# EAGLE design Actuator_v2 (EAGLE 9.6.2)

## Sheet 1 of 2: Part Schematics
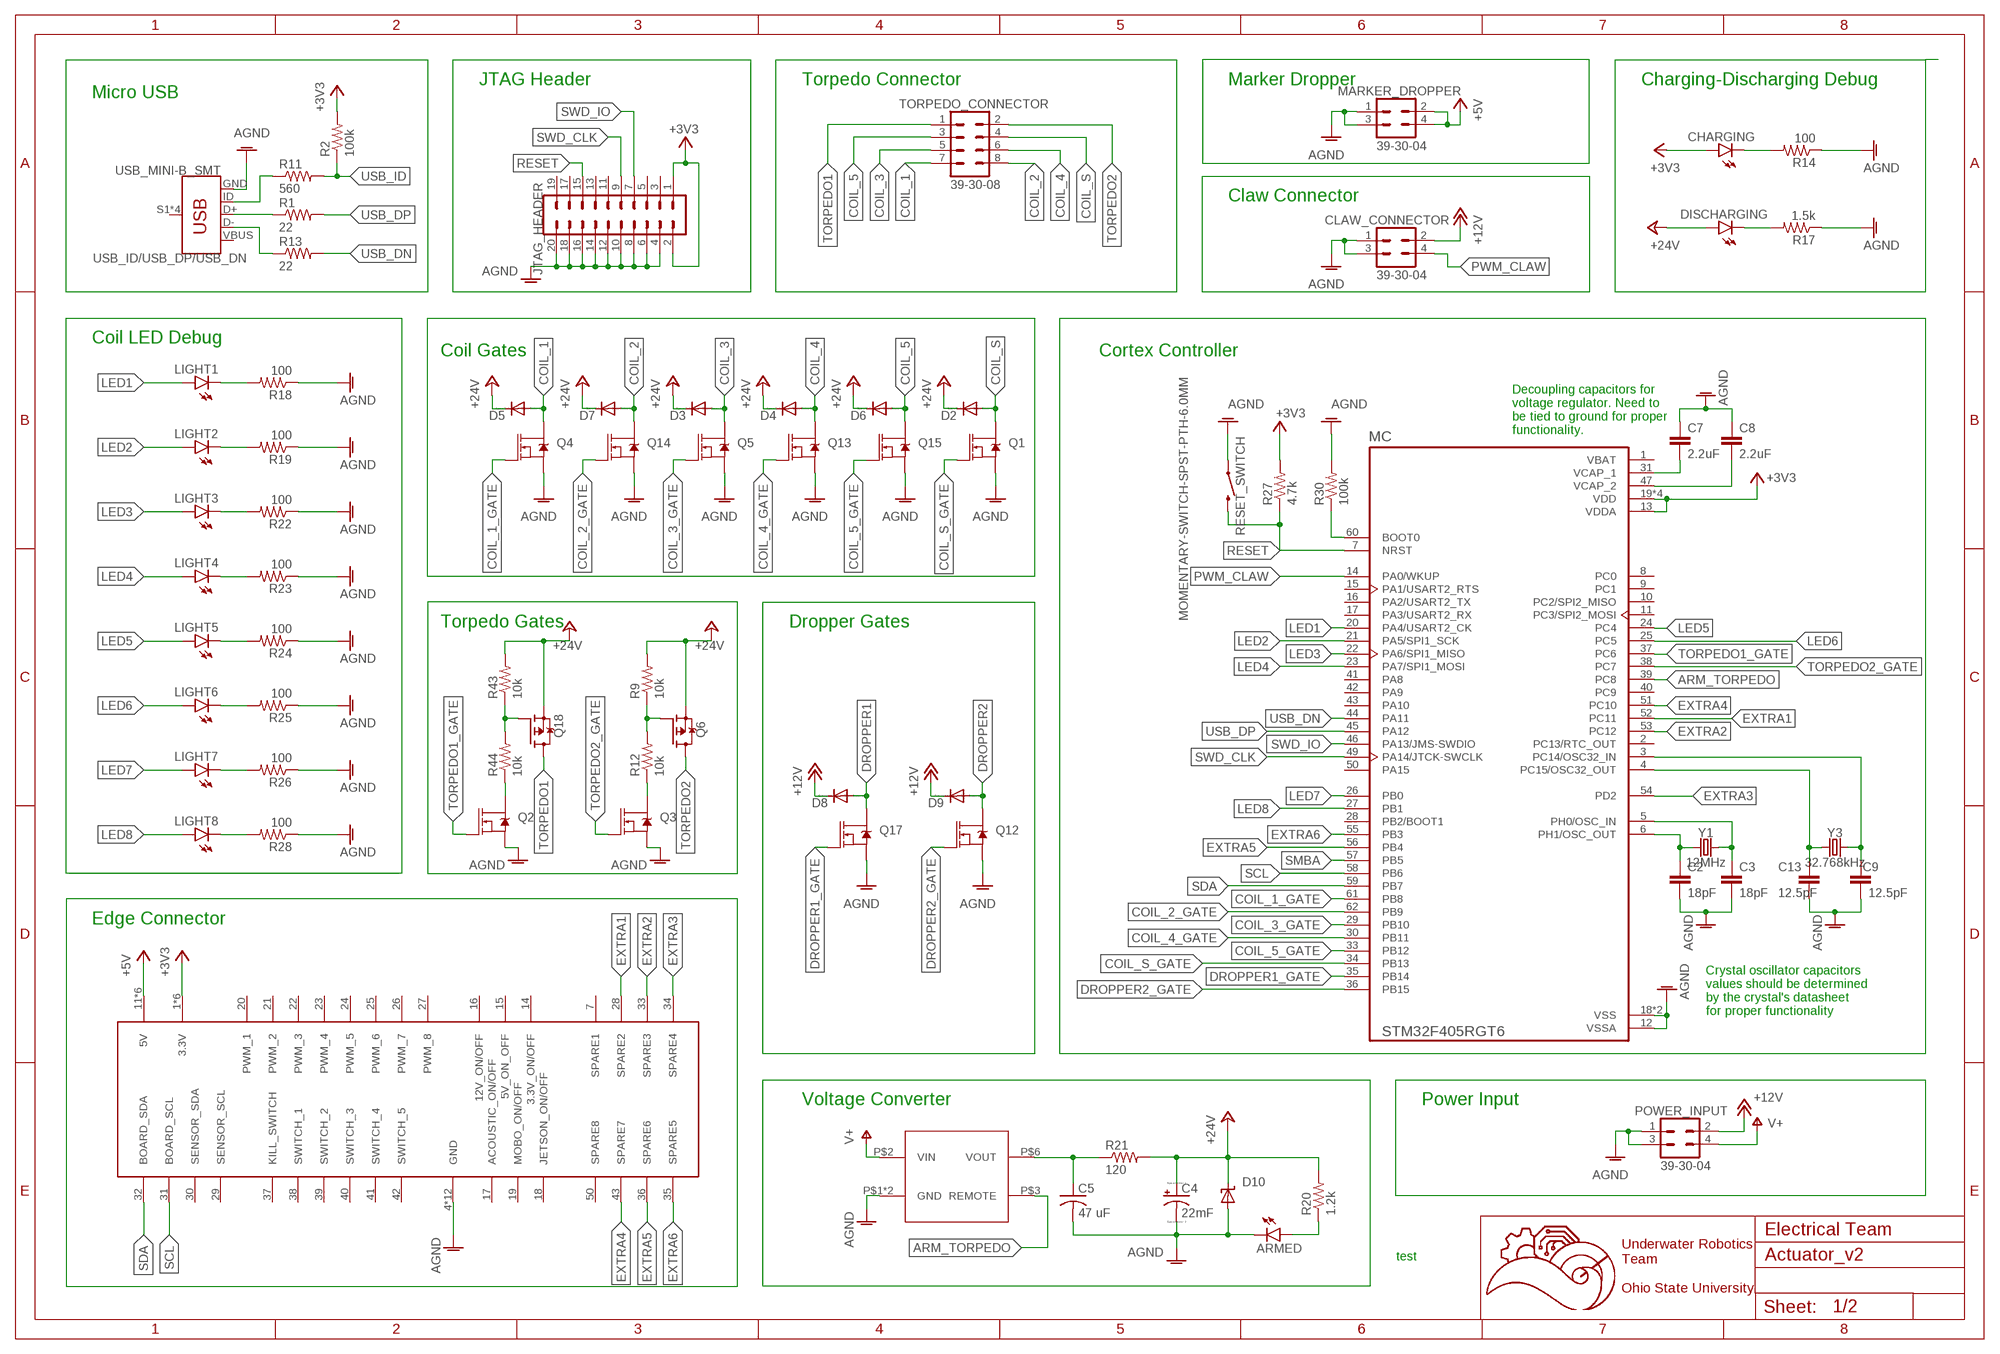
[diagram p0: schematic, sheet 1]

### Parts
ARMED  LEDCHIPLED_0603  [CHIPLED_0603]
C2  18pF  C-EUC0603  [C0603]
C3  18pF  C-EUC0603  [C0603]
C4  22mF  CPOL-USE10-30  [EB30D]
C5  47 uF  C-USC1206K  [C1206K]
C7  2.2uF  C-EUC0603  [C0603]
C8  2.2uF  C-EUC0603  [C0603]
C9  12.5pF  C-EUC0603  [C0603]
C13  12.5pF  C-EUC0603  [C0603]
CHARGING  LEDCHIPLED_0603  [CHIPLED_0603]
CLAW_CONNECTOR  39-30-04  [39-30-?04?]
D2  DIODE-SMB  [SMB]
D3  DIODE-SMB  [SMB]
D4  DIODE-SMB  [SMB]
D5  DIODE-SMB  [SMB]
D6  DIODE-SMB  [SMB]
D7  DIODE-SMB  [SMB]
D8  DIODE-SMB  [SMB]
D9  DIODE-SMB  [SMB]
D10  SUPPRESSOR-SMBJ  [SMBJ]
DISCHARGING  LEDCHIPLED_0603  [CHIPLED_0603]
JTAG_HEADER  CONN_10X2  [2X10]
LIGHT1  LEDCHIPLED_0603  [CHIPLED_0603]
LIGHT2  LEDCHIPLED_0603  [CHIPLED_0603]
LIGHT3  LEDCHIPLED_0603  [CHIPLED_0603]
LIGHT4  LEDCHIPLED_0603  [CHIPLED_0603]
LIGHT5  LEDCHIPLED_0603  [CHIPLED_0603]
LIGHT6  LEDCHIPLED_0603  [CHIPLED_0603]
LIGHT7  LEDCHIPLED_0603  [CHIPLED_0603]
LIGHT8  LEDCHIPLED_0603  [CHIPLED_0603]
MARKER_DROPPER  39-30-04  [39-30-?04?]
MC  STM32F405RGT6  [QFP50P1200X1200X160-64N]
POWER_INPUT  39-30-04  [39-30-?04?]
Q1  MOSFET-NCH-AO3404A  [SOT23-3]
Q2  MOSFET-NCH-AO3404A  [SOT23-3]
Q3  MOSFET-NCH-AO3404A  [SOT23-3]
Q4  MOSFET-NCH-AO3404A  [SOT23-3]
Q5  MOSFET-NCH-AO3404A  [SOT23-3]
Q6  FDD4141TO252  [TO252]
Q12  MOSFET-NCH-AO3404A  [SOT23-3]
Q13  MOSFET-NCH-AO3404A  [SOT23-3]
Q14  MOSFET-NCH-AO3404A  [SOT23-3]
Q15  MOSFET-NCH-AO3404A  [SOT23-3]
Q17  MOSFET-NCH-AO3404A  [SOT23-3]
Q18  FDD4141TO252  [TO252]
R1  22  R-US_R0603  [R0603]
R2  100k  R-US_R0603  [R0603]
R9  10k  R-US_R0603  [R0603]
R11  560  R-US_R0603  [R0603]
R12  10k  R-US_R0603  [R0603]
R13  22  R-US_R0603  [R0603]
R14  100  R-US_R0805  [R0805]
R17  1.5k  R-US_R0805  [R0805]
R18  100  R-US_R0805  [R0805]
R19  100  R-US_R0805  [R0805]
R20  1.2k  R-US_R0805  [R0805]
R21  120  R-US_R6332W  [R6332W]
R22  100  R-US_R0805  [R0805]
R23  100  R-US_R0805  [R0805]
R24  100  R-US_R0805  [R0805]
R25  100  R-US_R0805  [R0805]
R26  100  R-US_R0805  [R0805]
R27  4.7k  R-US_R0603  [R0603]
R28  100  R-US_R0805  [R0805]
R30  100k  R-US_R0603  [R0603]
R43  10k  R-US_R0603  [R0603]
R44  10k  R-US_R0603  [R0603]
RESET_SWITCH  MOMENTARY-SWITCH-SPST-PTH-6.0MM  [TACTILE_SWITCH_PTH_6.0MM]
TORPEDO_CONNECTOR  39-30-08  [39-30-?08?]
U$1  5530843-EDGE  [5530843-6-BOARDFINGERS]
U$6  TMR6-2415  [TMR6-2415]
USB_ID/USB_DP/USB_DN  USB_MINI-B_SMT  [USB-MINIB]
Y1  12MHz  CRYSTAL-16MHZPTH-HC49US  [HC49US]
Y3  32.768kHz  CRYSTAL-32.768KHZSMD-3.2X1.5  [CRYSTAL-SMD-3.2X1.5MM]

### Nets
+3V3: CHARGING.A JTAG_HEADER.1 JTAG_HEADER.2 MC.13(VDDA) MC.19(VDD) MC.32(VDD) MC.48(VDD) MC.64(VDD) R2.2 R27.2 U$1.1(3.3V) U$1.2(3.3V) U$1.3(3.3V) U$1.54(3.3V) U$1.55(3.3V) U$1.56(3.3V)
+5V: MARKER_DROPPER.2 MARKER_DROPPER.4 U$1.11(5V) U$1.12(5V) U$1.13(5V) U$1.44(5V) U$1.45(5V) U$1.46(5V)
+12V: CLAW_CONNECTOR.2 D8.C D9.C POWER_INPUT.2
+24V: C4.+ D2.C D3.C D4.C D5.C D6.C D7.C D10.C DISCHARGING.A Q6.2(S) Q18.2(S) R9.2 R20.2 R21.2 R43.2
AGND: ARMED.C C2.2 C3.2 C4.- C5.2 C7.1 C8.1 C9.2 C13.2 CLAW_CONNECTOR.1 CLAW_CONNECTOR.3 D10.A JTAG_HEADER.4 JTAG_HEADER.6 JTAG_HEADER.8 JTAG_HEADER.10 JTAG_HEADER.12 JTAG_HEADER.14 JTAG_HEADER.16 JTAG_HEADER.18 JTAG_HEADER.20 MARKER_DROPPER.1 MARKER_DROPPER.3 MC.12(VSSA) MC.18(VSS) MC.63(VSS) POWER_INPUT.1 POWER_INPUT.3 Q1.2(S) Q2.2(S) Q3.2(S) Q4.2(S) Q5.2(S) Q12.2(S) Q13.2(S) Q14.2(S) Q17.2(S) R14.1 R17.1 R18.1 R19.1 R22.1 R23.1 R24.1 R25.1 R26.1 R28.1 R30.2 RESET_SWITCH.1 U$1.4(GND) U$1.5(GND) U$1.6(GND) U$1.8(GND) U$1.9(GND) U$1.10(GND) U$1.47(GND) U$1.48(GND) U$1.49(GND) U$1.51(GND) U$1.52(GND) U$1.53(GND) U$6.P$1(GND) U$6.P$7(GND) USB_ID/USB_DP/USB_DN.GND
AGND1: Q15.2(S) ; supply symbol labelled AGND
ARM_TORPEDO: MC.39(PC8) U$6.P$3(REMOTE)
COIL_1: D5.A Q4.3(D) TORPEDO_CONNECTOR.7
COIL_1_GATE: MC.61(PB8) Q4.1(G)
COIL_2: D7.A Q14.3(D) TORPEDO_CONNECTOR.8
COIL_2_GATE: MC.62(PB9) Q14.1(G)
COIL_3: D3.A Q5.3(D) TORPEDO_CONNECTOR.5
COIL_3_GATE: MC.29(PB10) Q5.1(G)
COIL_4: D4.A Q13.3(D) TORPEDO_CONNECTOR.6
COIL_4_GATE: MC.30(PB11) Q13.1(G)
COIL_5: D6.A Q15.3(D) TORPEDO_CONNECTOR.3
COIL_5_GATE: MC.33(PB12) Q15.1(G)
COIL_S: D2.A Q1.3(D) TORPEDO_CONNECTOR.4
COIL_S_GATE: MC.34(PB13) Q1.1(G)
DROPPER1: D8.A Q17.3(D)
DROPPER1_GATE: MC.35(PB14) Q17.1(G)
DROPPER2: D9.A Q12.3(D)
DROPPER2_GATE: MC.36(PB15) Q12.1(G)
EXTRA1: MC.52(PC11) U$1.28(SPARE2)
EXTRA2: MC.53(PC12) U$1.33(SPARE3)
EXTRA3: MC.54(PD2) U$1.34(SPARE4)
EXTRA4: MC.51(PC10) U$1.43(SPARE7)
EXTRA5: MC.56(PB4) U$1.36(SPARE6)
EXTRA6: MC.55(PB3) U$1.35(SPARE5)
LED1: LIGHT1.A MC.20(PA4/USART2_CK)
LED2: LIGHT2.A MC.21(PA5/SPI1_SCK)
LED3: LIGHT3.A MC.22(PA6/SPI1_MISO)
LED4: LIGHT4.A MC.23(PA7/SPI1_MOSI)
LED5: LIGHT5.A MC.24(PC4)
LED6: LIGHT6.A MC.25(PC5)
LED7: LIGHT7.A MC.26(PB0)
LED8: LIGHT8.A MC.27(PB1)
N$2: C2.1 MC.6(PH1/OSC_OUT) Y1.1
N$3: C3.1 MC.5(PH0/OSC_IN) Y1.2
N$4: CHARGING.C R14.2
N$5: C8.2 MC.47(VCAP_2)
N$6: R11.1 USB_ID/USB_DP/USB_DN.ID
N$7: R1.1 USB_ID/USB_DP/USB_DN.D+
N$8: R13.1 USB_ID/USB_DP/USB_DN.D-
N$10: ARMED.A R20.1
N$11: C7.2 MC.31(VCAP_1)
N$12: C13.1 MC.4(PC15/OSC32_OUT) Y3.P$2
N$15: DISCHARGING.C R17.2
N$16: LIGHT1.C R18.2
N$17: LIGHT2.C R19.2
N$18: LIGHT3.C R22.2
N$19: LIGHT4.C R23.2
N$21: LIGHT5.C R24.2
N$22: LIGHT6.C R25.2
N$23: LIGHT7.C R26.2
N$24: LIGHT8.C R28.2
N$26: C5.1 R21.1 U$6.P$6(VOUT)
N$29: C9.1 MC.3(PC14/OSC32_IN) Y3.P$1
N$30: MC.60(BOOT0) R30.1
N$33: Q18.1(G) R43.1 R44.2
N$34: Q2.3(D) R44.1
N$35: Q6.1(G) R9.1 R12.2
N$36: Q3.3(D) R12.1
PWM_CLAW: CLAW_CONNECTOR.4 MC.14(PA0/WKUP)
RESET: JTAG_HEADER.15 MC.7(NRST) R27.1 RESET_SWITCH.3
SCL: MC.58(PB6) U$1.31(BOARD_SCL)
SDA: MC.59(PB7) U$1.32(BOARD_SDA)
SMBA: MC.57(PB5)
SWD_CLK: JTAG_HEADER.9 MC.49(PA14/JTCK-SWCLK)
SWD_IO: JTAG_HEADER.7 MC.46(PA13/JMS-SWDIO)
TORPEDO1: Q18.3(D) TORPEDO_CONNECTOR.1
TORPEDO1_GATE: MC.37(PC6) Q2.1(G)
TORPEDO2: Q6.3(D) TORPEDO_CONNECTOR.2
TORPEDO2_GATE: MC.38(PC7) Q3.1(G)
USB_DN: MC.44(PA11) R13.2
USB_DP: MC.45(PA12) R1.2
USB_ID: R2.1 R11.2
V+: POWER_INPUT.4 U$6.P$2(VIN)
Unconnected: JTAG_HEADER.3 JTAG_HEADER.5 JTAG_HEADER.11 JTAG_HEADER.13 JTAG_HEADER.17 JTAG_HEADER.19 MC.2(PC13/RTC_OUT) MC.8(PC0) MC.9(PC1) MC.10(PC2/SPI2_MISO) MC.11(PC3/SPI2_MOSI) MC.15(PA1/USART2_RTS) MC.16(PA2/USART2_TX) MC.17(PA3/USART2_RX) MC.28(PB2/BOOT1) MC.40(PC9) MC.41(PA8) MC.42(PA9) MC.43(PA10) MC.50(PA15) U$1.7(SPARE1) U$1.14(3.3V_ON/OFF) U$1.15(5V_ON_OFF) U$1.16(12V_ON/OFF) U$1.17(ACOUSTIC_ON/OFF) U$1.18(JETSON_ON/OFF) U$1.19(MOBO_ON/OFF) U$1.20(PWM_1) U$1.21(PWM_2) U$1.22(PWM_3) U$1.23(PWM_4) U$1.24(PWM_5) U$1.25(PWM_6) U$1.26(PWM_7) U$1.27(PWM_8) U$1.29(SENSOR_SCL) U$1.30(SENSOR_SDA) U$1.37(KILL_SWITCH) U$1.38(SWITCH_1) U$1.39(SWITCH_2) U$1.40(SWITCH_3) U$1.41(SWITCH_4) U$1.42(SWITCH_5) U$1.50(SPARE8) USB_ID/USB_DP/USB_DN.S1(SHIELD) USB_ID/USB_DP/USB_DN.S2(SHIELD) USB_ID/USB_DP/USB_DN.S3(SHIELD) USB_ID/USB_DP/USB_DN.S4(SHIELD)

### Notes on the sheet
- JTAG Header | Torpedo Connector | Marker Dropper | Charging-Discharging Debug
- Micro USB
- Claw Connector
- Coil LED Debug
- Coil Gates | Cortex Controller
- Decoupling capacitors for 
  voltage regulator. Need to
  be tied to ground for proper
  functionality.
- Torpedo Gates | Dropper Gates
- Edge Connector
- Crystal oscillator capacitors
  values should be determined
  by the crystal's datasheet
  for proper functionality
- Voltage Converter | Power Input
- Electrical Team
- test
- Underwater Robotics
  Team
  
  Ohio State University

## Sheet 2 of 2: Notes
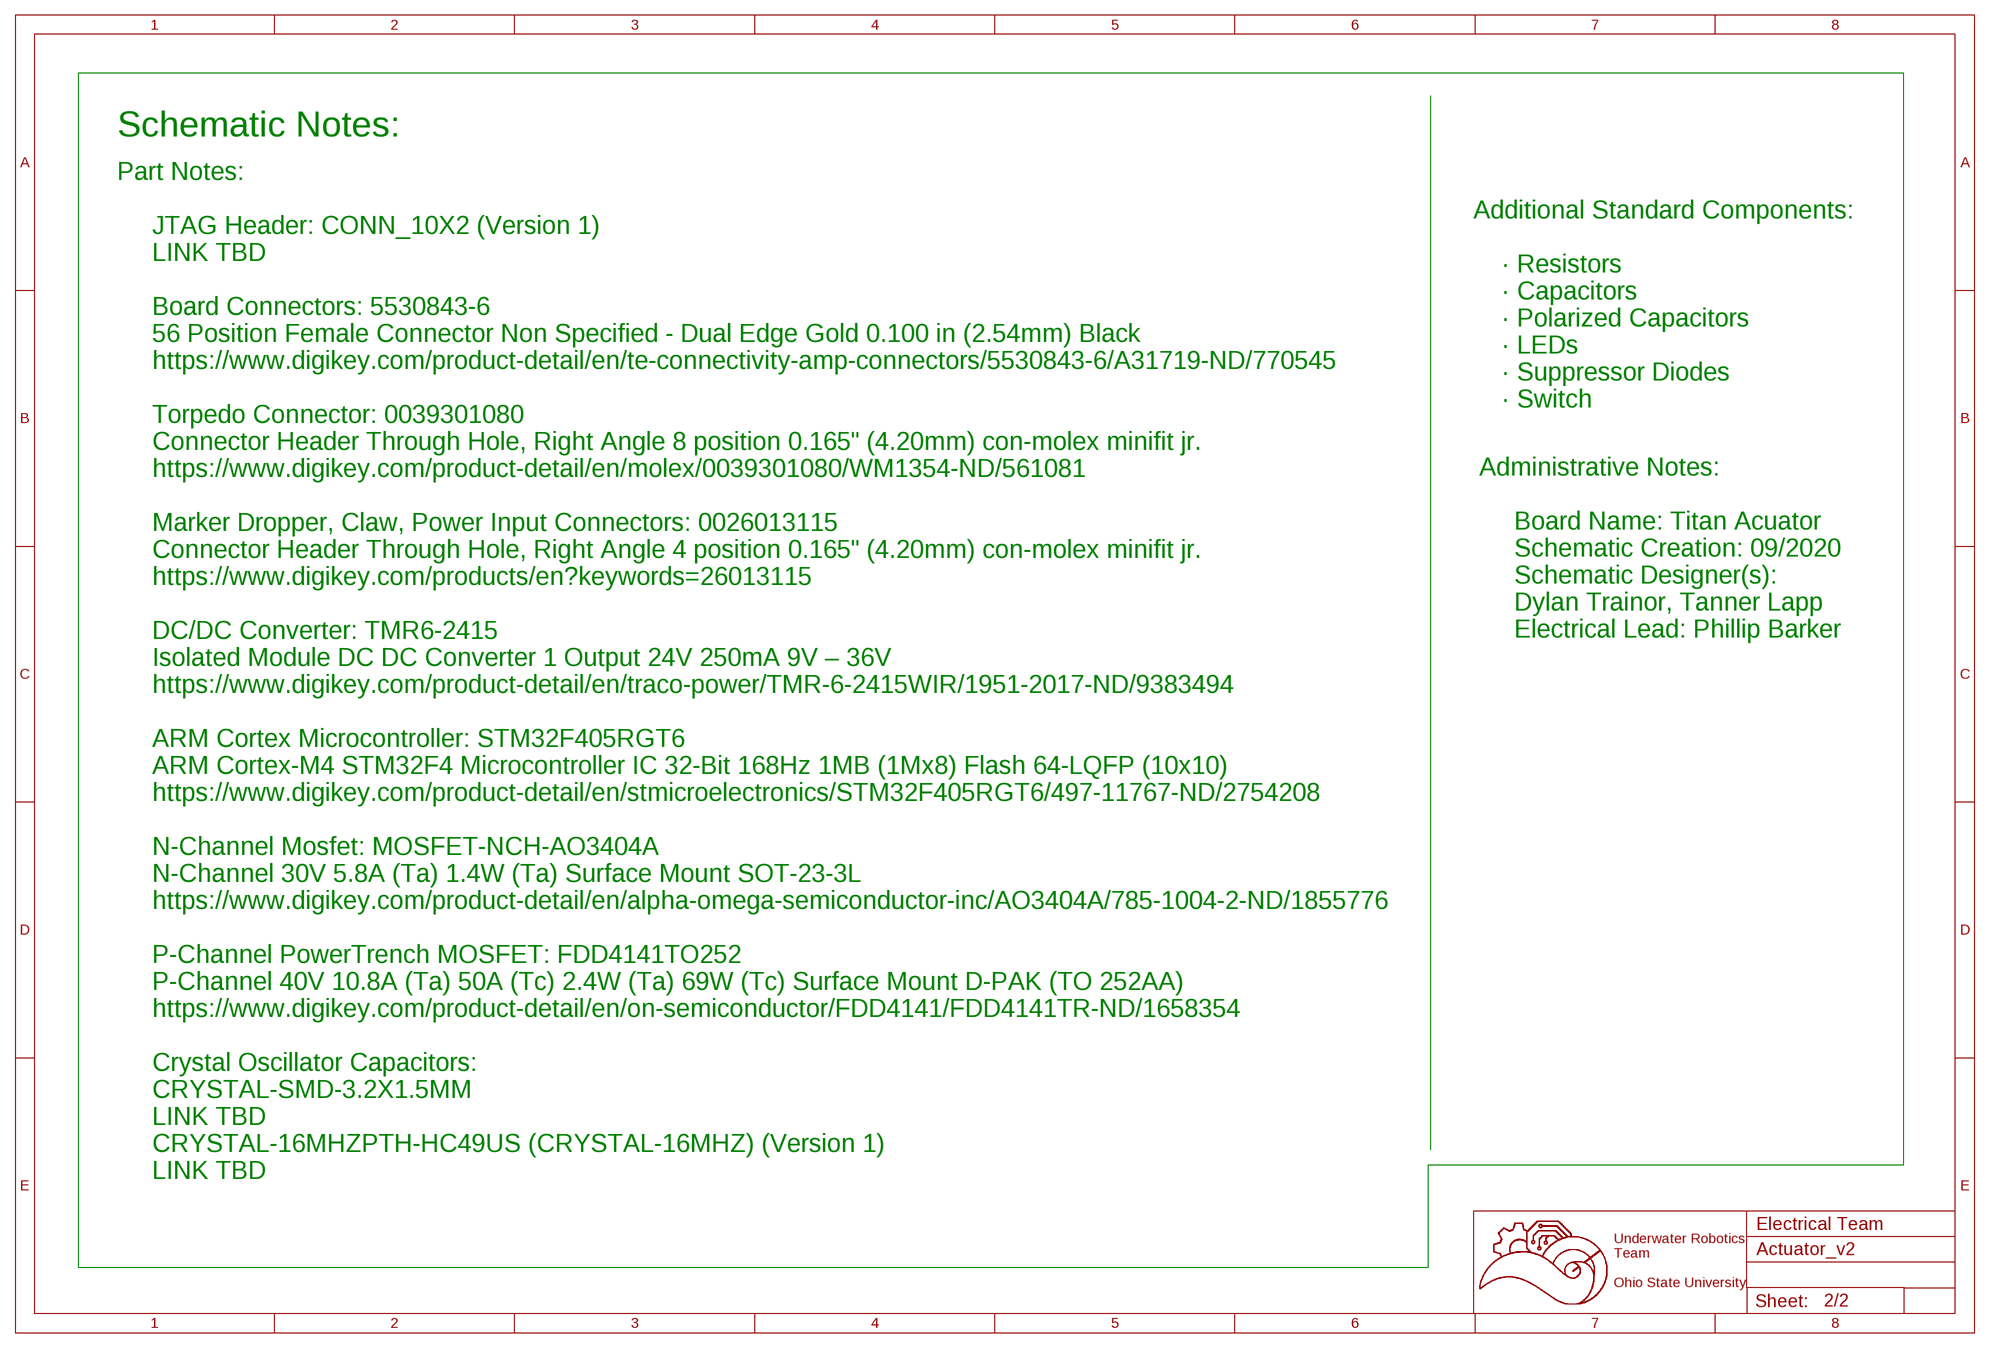
[diagram p1: schematic, sheet 2]

### Notes on the sheet
- Schematic Notes:
- Part Notes:
  
       JTAG Header: CONN_10X2 (Version 1) 
       LINK TBD 
    
       Board Connectors: 5530843-6 
       56 Position Female Connector Non Specified - Dual Edge Gold 0.100 in (2.54mm) Black 
       https://www.digikey.com/product-detail/en/te-connectivity-amp-connectors/5530843-6/A31719-ND/770545 
    
       Torpedo Connector: 0039301080 
       Connector Header Through Hole, Right Angle 8 position 0.165" (4.20mm) con-molex minifit jr. 
       https://www.digikey.com/product-detail/en/molex/0039301080/WM1354-ND/561081 
    
       Marker Dropper, Claw, Power Input Connectors: 0026013115 
       Connector Header Through Hole, Right Angle 4 position 0.165" (4.20mm) con-molex minifit jr. 
       https://www.digikey.com/products/en?keywords=26013115 
    
       DC/DC Converter: TMR6-2415 
       Isolated Module DC DC Converter 1 Output 24V 250mA 9V – 36V 
       https://www.digikey.com/product-detail/en/traco-power/TMR-6-2415WIR/1951-2017-ND/9383494 
    
       ARM Cortex Microcontroller: STM32F405RGT6 
       ARM Cortex-M4 STM32F4 Microcontroller IC 32-Bit 168Hz 1MB (1Mx8) Flash 64-LQFP (10x10) 
       https://www.digikey.com/product-detail/en/stmicroelectronics/STM32F405RGT6/497-11767-ND/2754208 
    
       N-Channel Mosfet: MOSFET-NCH-AO3404A 
       N-Channel 30V 5.8A (Ta) 1.4W (Ta) Surface Mount SOT-23-3L 
       https://www.digikey.com/product-detail/en/alpha-omega-semiconductor-inc/AO3404A/785-1004-2-ND/1855776 
    
       P-Channel PowerTrench MOSFET: FDD4141TO252 
       P-Channel 40V 10.8A (Ta) 50A (Tc) 2.4W (Ta) 69W (Tc) Surface Mount D-PAK (TO 252AA) 
       https://www.digikey.com/product-detail/en/on-semiconductor/FDD4141/FDD4141TR-ND/1658354 
    
       Crystal Oscillator Capacitors: 
       CRYSTAL-SMD-3.2X1.5MM 
       LINK TBD 
       CRYSTAL-16MHZPTH-HC49US (CRYSTAL-16MHZ) (Version 1) 
       LINK TBD
- Additional Standard Components:
  
       · Resistors 
       · Capacitors 
       · Polarized Capacitors 
       · LEDs 
       · Suppressor Diodes 
       · Switch
- Administrative Notes:
  
       Board Name: Titan Acuator
       Schematic Creation: 09/2020
       Schematic Designer(s): 
       Dylan Trainor, Tanner Lapp
       Electrical Lead: Phillip Barker
- Electrical Team
- Underwater Robotics
  Team
  
  Ohio State University

## Power pins joined to a net without a drawn wire
VBAT: MC.1(VBAT)
VBUS: USB_ID/USB_DP/USB_DN.VBUS

## Library data of the parts
ARMED CHARGING DISCHARGING LIGHT1-LIGHT8 = led:LED: LED OSRAM: - CHIPLED LG R971, LG N971, LY N971, LG Q971, LY Q971, LO R971, LY R971 LH N974, LH R974 LS Q976, LO Q976, LY Q976 LO Q996 - Hyper CHIPLED LW Q18S LB Q993, LB Q99A, LB R99A - SideLED LS A670, LO A670, LY A670, LG A670, LP A670 LB A673, LV A673, LT A673, LW A673 LH A674 LY A675 LS A676, LA A676, LO A676, LY A676, LW A676 LS A679, LY A679, LG A679 - Hyper Micro SIDELED® LS Y876, LA Y876, LO Y876, LY Y876 LT Y87S - SmartLED LW L88C, LW L88S LB L89C, LB L89S, LG L890 LS L89K, LO L89K, LY L89K LS L896, LA L896, LO L896, LY L896 - TOPLED LS T670, LO T670, LY T670, LG T670, LP T670 LSG T670, LSP T670, LSY T670, LOP T670, LYG T670 LG T671, LOG T671, LSG T671 LB T673, LV T673, LT T673, LW T673 LH T674 LS T676, LA T676, LO T676, LY T676, LB T676, LH T676, LSB T676, LW T676 LB T67C, LV T67C, LT T67C, LS T67K, LO T67K, LY T67K, LW E67C LS E67B, LA E67B, LO E67B, LY E67B, LB E67C, LV E67C, LT E67C LW T67C LS T679, LY T679, LG T679 LS T770, LO T770, LY T770, LG T770, LP T770 LB T773, LV T773, LT T773, LW T773 LH T774 LS E675, LA E675, LY E675, LS T675 LS T776, LA T776, LO T776, LY T776, LB T776 LHGB T686 LT T68C, LB T68C - Hyper Mini TOPLED® LB M676 - Mini TOPLED Santana® LG M470 LS M47K, LO M47K, LY M47K Source: http://www.osram.convergy.de LUXEON: - LUMILED® LXK2-PW12-R00, LXK2-PW12-S00, LXK2-PW14-U00, LXK2-PW14-V00 LXK2-PM12-R00, LXK2-PM12-S00, LXK2-PM14-U00 LXK2-PE12-Q00, LXK2-PE12-R00, LXK2-PE12-S00, LXK2-PE14-T00, LXK2-PE14-U00 LXK2-PB12-K00, LXK2-PB12-L00, LXK2-PB12-M00, LXK2-PB14-N00, LXK2-PB14-P00, LXK2-PB14-Q00 LXK2-PR12-L00, LXK2-PR12-M00, LXK2-PR14-Q00, LXK2-PR14-R00 LXK2-PD12-Q00, LXK2-PD12-R00, LXK2-PD12-S00 LXK2-PH12-R00, LXK2-PH12-S00 LXK2-PL12-P00, LXK2-PL12-Q00, LXK2-PL12-R00 Source: www.luxeon.com KINGBRIGHT: KA-3528ASYC Source: www.kingbright.com
C2 C3 C7-C9 C13 = rcl:C-EU: CAPACITOR, European symbol; SPICEPREFIX: C
C4 = resistor:CPOL-US: POLARIZED CAPACITOR, American symbol
C5 = resistor:C-US: CAPACITOR, American symbol
CLAW_CONNECTOR MARKER_DROPPER POWER_INPUT = con-molex-mini-fit:39-30-?04?: HEADER
D2-D9 = diode:DIODE-: DIODE
D10 = diode:SUPPRESSOR-: Suppressor diode
JTAG_HEADER = SparkFun-Connectors:CONN_10X2: Multi connection point. Often used as Generic Header-pin footprint for 0.1 inch spaced/style header connections On any of the 0.1 inch spaced packages, you can populate with these: Break Away Headers - Straight <https://www.sparkfun.com/products/116> (PRT-00116) Break Away Male Headers - Right Angle <https://www.sparkfun.com/products/553> (PRT-00553) Female Headers <https://www.sparkfun.com/products/115> (PRT-00115) Break Away Headers - Machine Pin <https://www.sparkfun.com/products/117> (PRT-00117) Break Away Female Headers - Swiss Machine Pin <https://www.sparkfun.com/products/743> (PRT-00743) Special note about the "SPECIAL" package: This was SPECIALLY designed to be used with our Graphic LCD Backpack. Be sure you want to use this! It is not only staggered on each line of header holes, but IT IS ALSO offset of the center point of the top and bottom lines by 5 mil. This causes the headers to lock into place on the "standard" footprint on the LCD screen. The extra squares on the tdocu layer are there simply to reference other pins (if you were to actually populate a longer header than ten long - this is what we do with the backpacks).
MC = STM32F405RGT6:STM32F405RGT6: High-performance foundation line, ARM Cortex-M4 core with DSP and FPU, 1 Mbyte Flash, 168 MHz CPU, ART Accelerator; AVAILABILITY: Unavailable; DESCRIPTION: High-performance foundation line, ARM Cortex-M4 core with DSP and FPU, 1 Mbyte Flash, 168 MHz CPU, ART Accelerator; MF: STMicroelectronics; MP: STM32F405RGT6; PACKAGE: LQFP-64 STMicroelectronics; PRICE: None
Q1-Q5 Q12-Q15 Q17 = SparkFun-DiscreteSemi:MOSFET-NCH: N-channel MOSFETs Voltage controlled devices that allow control of high current outputs. SparkFun Products: SparkFun OpenScale <https://www.sparkfun.com/products/13261> SparkFun Digital Sandbox <https://www.sparkfun.com/products/12651> SparkFun Monster Moto Shield <https://www.sparkfun.com/products/10182> SparkFun MOSFET Power Controller <https://www.sparkfun.com/products/11214>; PROD_ID: TRANS-12988; VALUE: 5.8A/30V/35mΩ
Q6 Q18 = transistor-fet:FDD4141: P-Channel PowerTrench® MOSFET Source: FDD4141.pdf
R1 R2 R11 R13 R27 R30 = rcl:R-US_: RESISTOR, American symbol; SPICEPREFIX: R
R9 R12 R14 R17-R26 R28 R43 R44 = resistor:R-US_: RESISTOR, American symbol
RESET_SWITCH = SparkFun-Switches:MOMENTARY-SWITCH-SPST: Momentary Switch (Pushbutton) - SPST Normally-open (NO) SPST momentary switches (buttons, pushbuttons). Variants PTH-12MM - 12mm square, through-hole Momentary Pushbutton Switch - 12mm Square <https://www.sparkfun.com/products/9190> (COM-09190) PTH-6.0MM, PTH-6.0MM-KIT - 6.0mm square, through-hole Mini Pushbutton Switch <https://www.sparkfun.com/products/97> (COM-00097) KIT package intended for soldering kit's - only one side of pads' copper is exposed. PTH-RIGHT-ANGLE-KIT - Right-angle, through-hole Right Angle Tactile Button <https://www.sparkfun.com/products/10791> - Used on SparkFun BigTime Watch Kit <https://www.sparkfun.com/products/11734> SMD-12MM - 12mm square, surface-mount Tactile Button - SMD (12mm) <https://www.sparkfun.com/products/12993> (COM-12993) Used on SparkFun PicoBoard <https://www.sparkfun.com/products/11888> SMD-4.5MM - 4.5mm Square Trackball Switch Used on SparkFun Blackberry Trackballer Breakout <https://www.sparkfun.com/products/13169> SMD-4.6MMX2.8MM - 4.60mm x 2.80mm, surface mount Used on SparkFun SAMD21 Mini Breakout <https://www.sparkfun.com/products/13664> SMD-5.2MM, SMD-5.2-REDUNDANT - 5.2mm square, surface-mount Mini Pushbutton Switch - SMD <https://www.sparkfun.com/products/8720> (COM-08720) Used on Arduino Pro Mini <https://www.sparkfun.com/products/11114> REDUNDANT package connects both switch circuits together SMD-6.0X3.5MM - 6.0 x 3.5mm, surface mount Momentary Reset Switch SMD <https://www.sparkfun.com/products/8229> (COM-08229) SMD-6.2MM-TALL - 6.2mm square, surface mount Tactile Button - SMD (6mm) <https://www.sparkfun.com/products/12992> Used on SparkFun Digital Sandbox <https://www.sparkfun.com/products/12651> SMD-RIGHT-ANGLE - Right-angle, surface mount Used on SparkFun Block for Intel® Edison - Arduino <https://www.sparkfun.com/products/13036>; PROD_ID: SWCH-08441; SF_SKU: COM-00097
TORPEDO_CONNECTOR = con-molex-mini-fit:39-30-?08?: HEADER
U$1 = 5530843-6:5530843-EDGE
U$6 = converter:TMR6-2415
USB_ID/USB_DP/USB_DN = SparkFun-Connectors:USB_MINI-B: USB type Mini-B Connector Breaks out 5th pin, and includes shield pins if needed. SparkFun Products: SparkFun FTDI Basic Breakout <https://www.sparkfun.com/products/9716> SparkFun XBee Explorer USB <https://www.sparkfun.com/products/11812> SparkFun Redboard <https://www.sparkfun.com/products/12757>; PROD_ID: CONN-08193; SF_ID: PRT-00587
Y1 = SparkFun-Clocks:CRYSTAL-16MHZ: 16MHz Crystal Digikey Example <http://www.digikey.com/product-search/en?keywords=535-9122-1-ND> Frequency: 16MHz Frequency Stability: ±50ppm Frequency Tolerance: ±20ppm Load Capacitance: 18pF SparkFun Products: Pro Micro -5V/16MHz <https://www.sparkfun.com/products/12640> SparkFun Serial Enabled LCD Kit <https://www.sparkfun.com/products/10097>; PROD_ID: XTAL-08181; SF_ID: COM-00536; VALUE: 16MHz
Y3 = SparkFun-Clocks:CRYSTAL-32.768KHZ: 32.768kHz Crystal Frequency: 32.768kHz Frequency Stability: ±20ppm Load Capacitance: 12.5pF (PTH-2X6 & SMD-3.2X1.5), 6pF (SMD-2X6) SparkFun Products: SparkFun BigTime Watch Kit <https://www.sparkfun.com/products/11734> SparkFun nRF52832 Breakout <https://www.sparkfun.com/products/13990> SparkFun Real Time Clock Module <https://www.sparkfun.com/products/12708>; PROD_ID: XTAL-13062

## Board
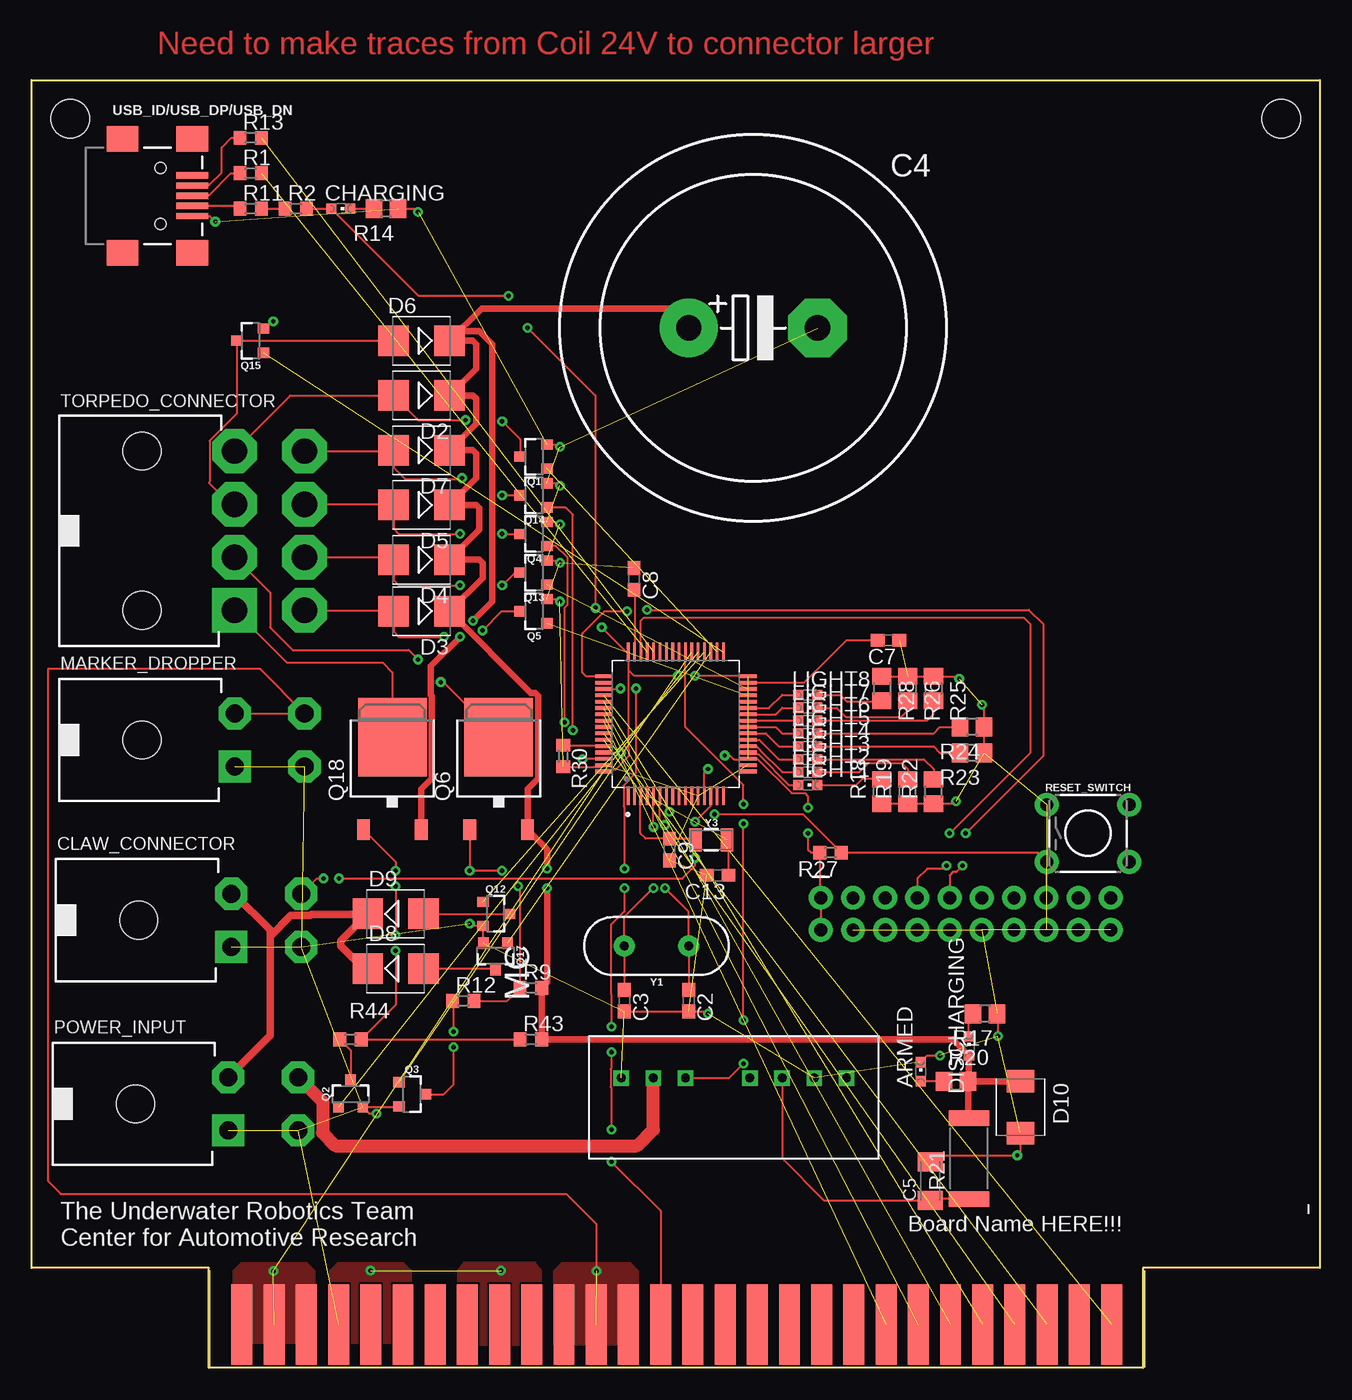
[diagram p2: board, top side]
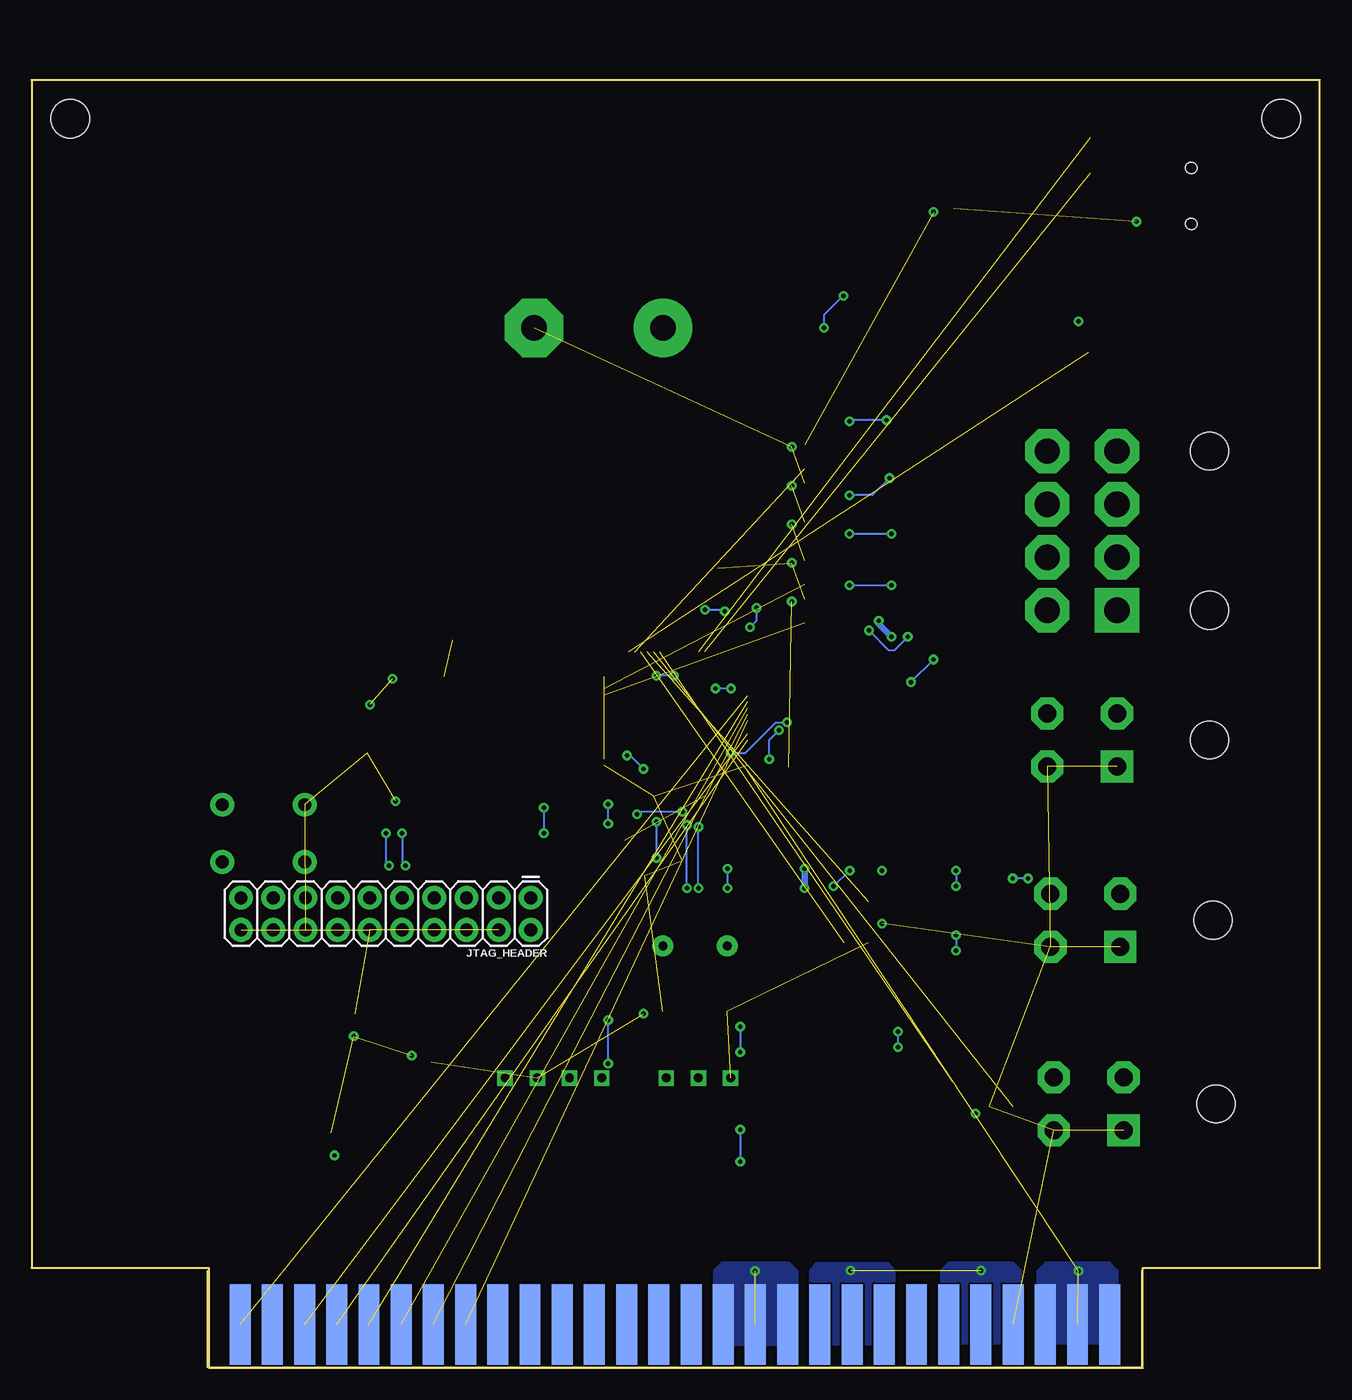
[diagram p3: board, bottom side, seen from below]

Size 101.6 x 101.6 mm. Coordinates in mm from the lower left corner, seen from the top.
Outline: 13.97,0 13.97,7.87 0,7.87 0,101.6 101.6,101.6 101.6,7.87 87.63,7.87 87.63,0 13.97,0
Copper layers (1*16): Top 0.035mm / dielectric 1.5mm / Bottom 0.035mm
Design rules "default": minimum track width 6mil, minimum drill 0.35mm, track to track 6mil, track to pad 6mil, pad to pad 6mil, via to via 6mil, smd to smd 6mil, copper to edge 40mil, drill to drill 6mil, minimum pad ring 10mil, minimum via ring 8mil, stop-mask expansion 4mil, vias tented up to drill 0mil, thermal gap 10mil
Holes 3.05 mm at 3.05,98.55 98.55,98.55

### Footprints (pad centres in the part's own frame; a part is rotated, then mirrored left to right if it is on the bottom)
CHIPLED_0603 = smd 0.8 x 0.8: A 0,-0.75; C 0,0.75
C0603 = smd 1.1 x 1: 1 -0.85,0; 2 0.85,0
EB30D = drill 2.007 pad 4.597: + -5.08,0 | drill 2.007 pad 4.597 octagon: - 5.08,0
C1206K = smd 1.5 x 2: 1 -1.5,0; 2 1.5,0
39-30-?04? = drill 1.422 pad 2.54 square: 1 2.095,0 | drill 1.422 pad 2.54 octagon: 2 -2.095,0; 3 2.095,5.512; 4 -2.095,5.512 | hole 3: 0,-7.3
SMB = smd 2.4 x 2.4: A 2.2,0; C -2.2,0
SMBJ = smd 1.78 x 2.16: A 2.04,0; C -2.03,0
2X10 = drill 1.016 pad 1.88: 1 0,0; 2 0,2.54; 3 2.54,0; 4 2.54,2.54; 5 5.08,0; 6 5.08,2.54; 7 7.62,0; 8 7.62,2.54; 9 10.16,0; 10 10.16,2.54; 11 12.7,0; 12 12.7,2.54; 13 15.24,0; 14 15.24,2.54; 15 17.78,0; 16 17.78,2.54; 17 20.32,0; 18 20.32,2.54; 19 22.86,0; 20 22.86,2.54
QFP50P1200X1200X160-64N = smd 1.47 x 0.28: 1 -5.67,3.75; 2 -5.67,3.25; 3 -5.67,2.75; 4 -5.67,2.25; 5 -5.67,1.75; 6 -5.67,1.25; 7 -5.67,0.75; 8 -5.67,0.25; 9 -5.67,-0.25; 10 -5.67,-0.75; 11 -5.67,-1.25; 12 -5.67,-1.75; 13 -5.67,-2.25; 14 -5.67,-2.75; 15 -5.67,-3.25; 16 -5.67,-3.75; 33 5.67,-3.75; 34 5.67,-3.25; 35 5.67,-2.75; 36 5.67,-2.25; 37 5.67,-1.75; 38 5.67,-1.25; 39 5.67,-0.75; 40 5.67,-0.25; 41 5.67,0.25; 42 5.67,0.75; 43 5.67,1.25; 44 5.67,1.75; 45 5.67,2.25; 46 5.67,2.75; 47 5.67,3.25; 48 5.67,3.75 | smd 0.28 x 1.47: 17 -3.75,-5.67; 18 -3.25,-5.67; 19 -2.75,-5.67; 20 -2.25,-5.67; 21 -1.75,-5.67; 22 -1.25,-5.67; 23 -0.75,-5.67; 24 -0.25,-5.67; 25 0.25,-5.67; 26 0.75,-5.67; 27 1.25,-5.67; 28 1.75,-5.67; 29 2.25,-5.67; 30 2.75,-5.67; 31 3.25,-5.67; 32 3.75,-5.67; 49 3.75,5.67; 50 3.25,5.67; 51 2.75,5.67; 52 2.25,5.67; 53 1.75,5.67; 54 1.25,5.67; 55 0.75,5.67; 56 0.25,5.67; 57 -0.25,5.67; 58 -0.75,5.67; 59 -1.25,5.67; 60 -1.75,5.67; 61 -2.25,5.67; 62 -2.75,5.67; 63 -3.25,5.67; 64 -3.75,5.67
SOT23-3 = smd 0.8 x 0.9: 1 -0.95,-1; 2 0.95,-1; 3 0,1.1
TO252 = smd 1 x 1.6: 1 -2.28,-4.8; 2 2.28,-4.8 | smd 5.4 x 6.2: 3 0,2.5
R0603 = smd 1 x 1.1: 1 -0.85,0; 2 0.85,0
R0805 = smd 1.3 x 1.5: 1 -0.95,0; 2 0.95,0
R6332W = smd 1.2 x 3.2: 1 -3.196,0; 2 3.196,0
TACTILE_SWITCH_PTH_6.0MM = drill 1.016 pad 1.88: 1 -3.251,2.261; 2 3.251,2.261; 3 -3.251,-2.261; 4 3.251,-2.261
39-30-?08? = drill 2 pad 3.5 square: 1 6.287,0 | drill 2 pad 3.5 octagon: 2 2.095,0; 3 -2.095,0; 4 -6.287,0; 5 6.287,5.512; 6 2.095,5.512; 7 -2.095,5.512; 8 -6.287,5.512 | hole 3: -6.287,-7.3; 6.287,-7.3
5530843-6-BOARDFINGERS = smd 1.651 x 6.35 bottom: 1 0.826,3.375; 2 3.365,3.375; 3 5.905,3.375; 4 8.445,3.375; 5 10.986,3.375; 6 13.525,3.375; 7 16.066,3.375; 8 18.605,3.375; 9 21.145,3.375; 10 23.686,3.375; 11 26.226,3.375; 12 28.765,3.375; 13 31.305,3.375; 14 33.846,3.375; 15 36.386,3.375; 16 38.925,3.375; 17 41.465,3.375; 18 44.005,3.375; 19 46.545,3.375; 20 49.086,3.375; 21 51.626,3.375; 22 54.166,3.375; 23 56.706,3.375; 24 59.245,3.375; 25 61.785,3.375; 26 64.326,3.375; 27 66.865,3.375; 28 69.406,3.375 | smd 1.651 x 6.35: 29 69.406,3.375; 30 66.865,3.375; 31 64.326,3.375; 32 61.785,3.375; 33 59.245,3.375; 34 56.706,3.375; 35 54.166,3.375; 36 51.626,3.375; 37 49.086,3.375; 38 46.545,3.375; 39 44.005,3.375; 40 41.465,3.375; 41 38.925,3.375; 42 36.386,3.375; 43 33.846,3.375; 44 31.305,3.375; 45 28.765,3.375; 46 26.226,3.375; 47 23.686,3.375; 48 21.145,3.375; 49 18.605,3.375; 50 16.066,3.375; 51 13.525,3.375; 52 10.986,3.375; 53 8.445,3.375; 54 5.905,3.375; 55 3.365,3.375; 56 0.826,3.375
TMR6-2415 = drill 0.7 square: P$1 0,0; P$2 2.54,0; P$3 5.08,0; P$5 10.16,0; P$6 12.7,0; P$7 15.24,0; P$8 17.78,0
USB-MINIB = smd 2.5 x 0.5: D+ 2.5,0; D- 2.5,0.8; GND 2.5,-1.6; ID 2.5,-0.8; VBUS 2.5,1.6 | smd 2.5 x 2: S1 -3,4.5; S2 2.5,4.5; S3 -3,-4.5; S4 2.5,-4.5 | hole 0.9: 0,2.2; 0,-2.2
HC49US = drill 0.7 pad 1.651: 1 -2.54,0; 2 2.54,0
CRYSTAL-SMD-3.2X1.5MM = smd 1 x 1.8: P$1 -1.25,0; P$2 1.25,0

### Placement (x,y rotation side)
ARMED  70.1,23.37 0 top
C2  51.82,28.96 270 top
C3  46.74,28.96 270 top
C4  56.9,82.04 0 top
C5  70.87,14.73 90 top
C7  67.56,57.4 180 top
C8  47.5,62.23 270 top
C9  50.29,40.89 270 top
C13  54.1,38.86 180 top
CHARGING  24.38,91.44 270 top
CLAW_CONNECTOR  39-30-04?  [39-30-?04?]  15.75,35.31 270 top
D2  30.73,76.71 180 top
D3  30.73,59.69 180 top
D4  30.73,63.75 180 top
D5  30.73,68.07 180 top
D6  30.73,81.03 180 top
D7  30.73,72.39 180 top
D8  28.7,31.5 0 top
D9  28.7,35.81 0 top
D10  77.98,20.57 270 top
DISCHARGING  73.91,25.4 0 top
JTAG_HEADER  62.23,37.08 180 bottom
LIGHT1  61.21,45.97 270 top
LIGHT2  61.21,46.99 270 top
LIGHT3  61.21,48.01 270 top
LIGHT4  61.21,49.02 270 top
LIGHT5  61.21,50.04 270 top
LIGHT6  61.21,51.05 270 top
LIGHT7  61.21,52.07 270 top
LIGHT8  61.21,53.09 270 top
MARKER_DROPPER  39-30-04?  [39-30-?04?]  16,49.53 270 top
MC  50.8,50.8 90 top
POWER_INPUT  39-30-04?  [39-30-?04?]  15.49,20.83 270 top
Q1  39.62,71.88 90 top
Q2  25.15,21.59 0 top
Q3  29.97,21.59 270 top
Q4  39.62,65.79 90 top
Q5  39.62,59.69 90 top
Q6  36.83,47.24 0 top
Q12  36.58,35.81 270 top
Q13  39.62,62.74 90 top
Q14  39.62,68.83 90 top
Q15  17.27,81.03 90 top
Q17  36.58,32.51 180 top
Q18  28.45,47.24 0 top
R1  17.27,94.23 0 top
R2  20.83,91.44 0 top
R9  39.37,29.97 0 top
R11  17.27,91.44 0 top
R12  34.04,28.96 0 top
R13  17.27,97.03 0 top
R14  27.94,91.44 180 top
R17  75.18,27.94 180 top
R18  67.06,45.47 90 top
R19  69.09,45.47 90 top
R20  72.9,22.61 0 top
R21  73.91,16.51 90 top
R22  71.12,45.47 90 top
R23  74.17,48.51 180 top
R24  74.17,50.55 180 top
R25  71.12,53.59 270 top
R26  69.09,53.59 270 top
R27  62.99,40.64 180 top
R28  67.06,53.59 270 top
R30  41.91,48.26 270 top
R43  39.37,25.91 0 top
R44  25.15,25.91 0 top
RESET_SWITCH  83.31,42.16 0 top
TORPEDO_CONNECTOR  39-30-08?  [39-30-?08?]  16,66.04 270 top
U$1  15.76,0.05 0 top
U$6  46.48,22.86 0 top
USB_ID/USB_DP/USB_DN  10.16,92.46 0 top
Y1  49.28,33.27 180 top
Y3  53.59,41.66 0 top

### Tracks (layer width: path | path; a pad name or v marks a point on that pad's centre or on a via)
+3V3  (via drill 0.35)  (3 unrouted)
  Top 0.152: R2.2 CHARGING.A 30.49,84.58 v37.59,84.58 | v61.21,44.2 61.21,45.09 60.96,45.34 59.92,45.34 57.22,48.05 MC.19 56.43,48.01 55.37,48.01 55.07,48.31 v54.66,48.31 | v61.21,42.16 61.21,40.89 61.47,40.64 R27.2 62.14,37.17 JTAG_HEADER.1 JTAG_HEADER.2 | MC.13 53.05,46.95 v53.34,47.24 | MC.48 47.05,55.06 47.5,54.61 v50.94,54.61 | v52.32,54.61 56.41,54.61 MC.32 | MC.64 45.26,47.18 46.01,47.18 47.09,48.26 47.09,48.77 47.05,48.8 MC.48 | v39.12,82.04 44.45,76.71 v44.45,59.94 | v44.96,58.42 46.91,56.47 MC.48
  Bottom 0.152: v61.21,44.2 v61.21,42.16 | v53.34,47.24 54.4,48.31 v54.66,48.31 | v50.94,54.61 v52.32,54.61 | v37.59,84.58 39.12,83.06 v39.12,82.04 | v44.45,59.94 44.45,58.93 v44.96,58.42
  other vias: 19.06,7.65
  pour Bottom (no thermals): 15.93,7.67 16.57,8.3 21.65,8.3 22.28,7.67 22.28,1.95 15.93,1.95
  pour Top (no thermals): 15.93,7.67 16.57,8.3 21.65,8.3 22.28,7.67 22.28,1.95 15.93,1.95
+5V  (via drill 0.35)  (1 unrouted)
  Top 0.152: MARKER_DROPPER.2 MARKER_DROPPER.4 18.02,55.12 1.27,55.12 1.27,14.73 2.29,13.72 42.16,13.72 44.52,11.36 U$1.12
  other vias: 44.56,7.65
  pour Top (no thermals): 41.2,1.83 41.2,7.67 41.84,8.3 47.17,8.3 47.81,7.67 47.81,1.83
  pour Bottom (no thermals): 41.2,1.83 41.2,7.67 41.84,8.3 47.17,8.3 47.81,7.67 47.81,1.83
+12V
  Top 0.152: D9.C 26.46,35.77
  Top 0.61: POWER_INPUT.2 18.8,26.23 18.8,34.04 | 18.8,34.04 18.8,34.54 15.94,37.4 CLAW_CONNECTOR.2 | 26.46,35.77 22.07,35.77 21.98,35.67 20.43,35.67 18.8,34.04 | D9.C 24.38,33.7 24.38,33.27 26.16,31.5 D8.C
+24V  (via drill 0.35)
  Top 0.508: D6.C 34.8,81.03 35.05,80.77 35.05,78.83 D2.C 34.8,76.71 35.05,76.45 35.05,74.51 D7.C 34.8,72.39 35.05,72.14 35.05,70.19 D5.C 35.05,68.07 35.31,67.82 35.31,66.13 D4.C 35.31,63.75 35.56,63.5 35.56,62.32 D3.C 39.37,53.25 39.7,53.25 39.94,53.01 39.94,46.48 39.11,45.65 Q6.2 40.64,40.91 v40.64,39.37 | D6.C 33.7,81.79 35.31,81.79 36.32,80.77 36.32,60.45 v34.8,58.93 | D6.C 35.47,83.57 50.29,83.57 C4.+ | v40.64,37.85 40.64,30.39 R9.2 R43.2 72.66,25.91 DISCHARGING.A 73.91,22.67 R20.2 | Q18.2 30.73,45.65 31.55,46.48 31.55,53.01 31.47,53.09 31.47,55.35 v33.78,57.66 | D10.C R20.2 | R20.2 73.85,19.77 R21.2
  Bottom 0.508: v34.8,58.93 34.8,58.67 v33.78,57.66 | v40.64,39.37 v40.64,37.85
AGND  (via drill 0.35)  (42 unrouted)
  Top 0.152: Q3.2 28.92,20.59 Q2.2 26.62,20.07 v27.18,20.07 | Q17.2 35.63,34.81 Q12.2 34.73,34.86 v34.54,35.05 | USB_ID/USB_DP/USB_DN.GND 14.05,90.86 v14.48,90.42 | R14.1 30.23,91.44 v30.48,91.19 | Q1.2 41.47,72.83 v41.66,72.64 | Q14.2 41.47,69.78 v41.66,69.6 | Q4.2 41.47,66.74 v41.66,66.55 | Q13.2 41.47,63.69 v41.66,63.5 | Q5.2 41.47,60.64 v41.66,60.45 | R28.1 R26.1 R25.1 72.96,54.54 v73.15,54.36 | R18.1 R19.1 R22.1 72.71,44.52 v72.9,44.7 | R23.1 R24.1 75.12,52.14 v74.93,52.32 | C3.2 C2.2 53.17,28.11 v53.34,27.94 | D10.A 77.98,17.02 v77.72,16.76 71.4,16.76 C5.2 | ARMED.C 70.62,24.64 v71.63,24.64 | R17.1 76.2,27.87 v76.2,26.16 | R30.2 44.31,47.41 44.32,47.42 45,47.42 MC.63
AGND1  (via drill 0.35)
  Top 0.152: Q15.2 18.85,82.55 v19.05,82.55
ARM_TORPEDO  (via drill 0.35)
  Top 0.152: U$6.P$3 55,22.86 v56.13,24 | v56.13,27.43 v56.13,42.93 | v56.13,44.45 56.13,45.97 51.55,50.56 MC.39
  Bottom 0.152: v56.13,24 v56.13,27.43 | v56.13,42.93 v56.13,44.45
COIL_1  (via drill 0.35)
  Top 0.152: TORPEDO_CONNECTOR.7 28.47,68.14 D5.A 28.53,66.21 28.96,65.79 v33.78,65.79 | v37.11,65.79 Q4.3
  Bottom 0.152: v33.78,65.79 v37.11,65.79
COIL_1_GATE  (via drill 0.35)
  Top 0.152: MC.61 46.45,48.55 v46.48,48.51 | v42.03,50.94 42.03,59.97 42.26,60.2 42.26,63.91 41.34,64.84 Q4.1
  Bottom 0.152: v42.03,50.94 42.06,50.9 42.92,50.9 45.31,48.51 v46.48,48.51
COIL_2  (via drill 0.35)
  Top 0.152: TORPEDO_CONNECTOR.8 28.47,72.33 D7.A 28.53,71.03 29.46,70.1 33.86,70.1 v33.95,70.19 | v37.11,68.83 Q14.3
  Bottom 0.152: v33.95,70.19 35.31,68.83 v37.11,68.83
COIL_2_GATE  (via drill 0.35)
  Top 0.152: MC.62 43.47,48.05 v43.43,48.02 | v42.67,50.29 42.67,67.31 42.1,67.88 Q14.1
  Bottom 0.152: v43.43,48.02 43.43,49.53 v42.67,50.29
COIL_3  (via drill 0.35)
  Top 0.152: TORPEDO_CONNECTOR.5 28.47,59.75 D3.A 28.53,58.08 28.96,57.66 v32.51,57.66 | v35.56,58.17 37.08,59.69 Q5.3
  Bottom 0.152: v32.51,57.66 33.58,56.59 34,56.59 35.56,58.16 v35.56,58.17
COIL_3_GATE  (1 unrouted)
COIL_4  (via drill 0.35)
  Top 0.152: TORPEDO_CONNECTOR.6 28.34,63.94 D4.A 28.53,62.14 28.96,61.72 v33.78,61.72 | v37.11,61.72 38.12,62.74 Q13.3
  Bottom 0.152: v33.78,61.72 v37.11,61.72
COIL_4_GATE  (1 unrouted)
COIL_5
  Top 0.152: TORPEDO_CONNECTOR.3 15.68,68.14 13.97,69.85 14.02,69.9 14.02,73.15 16.17,75.3 Q15.3 D6.A
COIL_5_GATE  (1 unrouted)
COIL_S  (via drill 0.35)
  Top 0.152: TORPEDO_CONNECTOR.4 20.38,76.71 D2.A 30.48,74.77 v34.2,74.77 | v37.11,74.68 38.52,73.26 Q1.3
  Bottom 0.152: v34.2,74.77 37.02,74.77 v37.11,74.68
COIL_S_GATE  (1 unrouted)
DROPPER1
  Top 0.152: D8.A 36.49,31.5 Q17.3
DROPPER1_GATE  (1 unrouted)
DROPPER2
  Top 0.152: D9.A Q12.3
DROPPER2_GATE  (1 unrouted)
EXTRA1  (1 unrouted)
EXTRA2  (1 unrouted)
EXTRA3  (1 unrouted)
EXTRA4  (via drill 0.35)
  Top 0.152: MC.51 46.4,53.55 v46.44,53.59 | v47.66,53.59 47.66,46.91 46.68,45.94 46.68,44.32 46.74,44.27 v46.74,39.37 | v46.74,37.85 46.74,35.99 45.68,34.94 45.68,29.49 45.72,29.45 v45.72,26.92 | v45.72,24.89 45.72,23.63 45.65,23.56 45.65,22.16 45.72,22.09 v45.72,18.8 | v45.72,16.26 49.6,12.37 U$1.43
  Bottom 0.152: v46.44,53.59 v47.66,53.59 | v46.74,39.37 v46.74,37.85 | v45.72,26.92 v45.72,24.89 | v45.72,18.8 v45.72,16.26
EXTRA5  (1 unrouted)
EXTRA6  (1 unrouted)
GND  (via drill 0.35)  (1 unrouted)
  other vias: 26.73,7.67 37.01,7.67
  pour Top (no thermals): 23.55,7.67 24.19,8.3 29.27,8.3 29.9,7.67 29.9,1.95 23.55,1.95
  pour Bottom (no thermals): 23.55,7.67 24.19,8.3 29.27,8.3 29.9,7.67 29.9,1.95 23.55,1.95
  pour Top (no thermals): 33.71,1.83 40.19,1.83 40.19,7.67 39.68,8.3 34.09,8.3 33.58,7.67 33.58,1.95
  pour Bottom (no thermals): 33.58,7.67 33.58,1.95 33.71,1.83 40.06,1.83 40.06,5.76 40.19,5.89 40.19,7.67 39.68,8.3 34.09,8.3
LED1
  Top 0.152: MC.20 56.6,48.42 57.28,48.42 59.72,45.97 LIGHT1.A
LED2
  Top 0.152: MC.21 57.15,49.05 57.43,48.76 57.43,48.74 59.18,46.99 LIGHT2.A
LED3
  Top 0.152: MC.22 57.38,49.55 58.93,48.01 LIGHT3.A
LED4
  Top 0.152: MC.23 57.9,50.05 58.93,49.02 LIGHT4.A
LED5
  Top 0.152: MC.24 58.67,50.55 59.18,50.04 LIGHT5.A
LED6
  Top 0.152: MC.25 LIGHT6.A
LED7
  Top 0.152: MC.26 58.66,51.55 59.18,52.07 LIGHT7.A
LED8
  Top 0.152: MC.27 58.15,52.05 59.18,53.09 LIGHT8.A
N$2  (via drill 0.35)
  Top 0.152: C2.1 Y1.1 51.82,35.96 v49.93,37.85 | v49.93,42.83 49.55,43.2 MC.6
  Bottom 0.152: v49.93,37.85 v49.93,42.83
N$3  (via drill 0.35)
  Top 0.152: C3.1 Y1.2 46.74,35.56 v49.02,37.85 | v49.02,42.67 49.02,45.1 MC.5
  Bottom 0.152: v49.02,37.85 v49.02,42.67
N$4
  Top 0.152: CHARGING.C R14.2
N$5
  Top 0.152: C8.2 47.55,61.33 MC.47
N$6
  Top 0.152: R11.1 16.21,91.66 USB_ID/USB_DP/USB_DN.ID
N$7
  Top 0.152: USB_ID/USB_DP/USB_DN.D+ 12.73,92.52 14.01,92.52 15.71,94.23 R1.1
N$8
  Top 0.152: USB_ID/USB_DP/USB_DN.D- 12.73,93.32 14.01,93.32 14.99,94.31 14.99,96.27 15.75,97.03 R13.1
N$10
  Top 0.152: R20.1 71.94,22.62 ARMED.A
N$11
  Top 0.152: MC.31 60.91,54.05 64.26,57.4 C7.2
N$12  (1 unrouted)
  Top 0.152: Y3.P$2 54.95,41.55 C13.1
N$15
  Top 0.152: DISCHARGING.C 73.91,27.62 R17.2
N$16
  Top 0.152: LIGHT1.C 65.02,45.97 65.53,46.48 66.99,46.48 R18.2
N$17
  Top 0.152: LIGHT2.C 65.28,46.99 65.99,47.7 68.63,47.7 69.09,47.24 R19.2
N$18
  Top 0.152: LIGHT3.C 70.36,48.01 71.12,47.24 R22.2
N$19
  Top 0.152: LIGHT4.C 71.12,49.02 71.63,48.51 R23.2
N$21
  Top 0.152: LIGHT5.C 71.12,50.04 71.63,50.55 R24.2
N$22
  Top 0.152: LIGHT6.C 70.61,51.05 71.12,51.56 R25.2
N$23
  Top 0.152: LIGHT7.C 63.5,52.07 64.21,51.36 68.58,51.36 69.09,51.87 R26.2
N$24
  Top 0.152: LIGHT8.C 63.75,53.09 64.26,52.58 66.99,52.58 R28.2
N$26
  Top 0.152: R21.1 71.2,13.31 C5.1 62.46,13.23 59.18,16.51 U$6.P$6
N$29
  Top 0.152: Y3.P$1 52.26,41.74 C9.1 48.43,41.74 48.01,42.16 48.01,45.09 MC.3
N$30
  Top 0.152: R30.1 45.07,49.11 MC.60
N$33  (via drill 0.35)
  Top 0.152: Q18.1 28.7,39.91 v28.7,39.22 | v28.7,38 v28.7,34.12 | v28.7,32.91 28.7,28.61 R44.2 R43.1
  Bottom 0.152: v28.7,39.22 v28.7,38 | v28.7,34.12 v28.7,32.91
N$34
  Top 0.152: R44.1 25.15,25.06 Q2.3
N$35  (via drill 0.35)
  Top 0.152: Q6.1 v34.55,39.22 v34.54,39.22 v37.08,39.22 | R12.2 37.5,28.96 R9.1 38.52,37.84 v38.35,38
  Bottom 0.152: v38.35,38 37.14,39.22 v37.08,39.22
N$36  (via drill 0.35)  (1 unrouted)
  Top 0.152: Q3.3 32.51,21.59 33.27,22.35 v33.27,25.3 | v33.27,26.52 33.27,28.87
  Bottom 0.152: v33.27,25.3 v33.27,26.52
PWM_CLAW  (via drill 0.35)
  Top 0.152: CLAW_CONNECTOR.4 22.47,38.61 v23.02,38.61 | v52.32,40.23 52.32,39.62 51.31,38.61 v24.23,38.61 | v52.32,43.09 53.55,44.31 MC.14
  Bottom 0.152: v23.02,38.61 v24.23,38.61 | v52.32,40.23 v52.32,43.09
RESET  (via drill 0.35)
  Top 0.152: JTAG_HEADER.15 80.01,39.85 RESET_SWITCH.3 79.32,40.64 R27.1 60.79,43.69 v53.85,43.69 | MC.7 50.05,44.11 v50.29,43.86
  Bottom 0.152: v50.29,43.86 53.67,43.86 v53.85,43.69
SCL  (1 unrouted)
SDA  (1 unrouted)
SWD_CLK  (via drill 0.35)
  Top 0.152: MC.49 43.75,54.55 43.43,54.86 43.43,57.91 45.21,59.69 v46.94,59.69 | v48.51,59.79 78.64,59.79 79.76,58.67 79.76,48.26 v73.66,42.16 | v73.41,39.62 72.9,39.12 72.64,39.12 72.39,38.86 JTAG_HEADER.9
  Bottom 0.152: v46.94,59.69 47.04,59.79 v48.51,59.79 | v73.66,42.16 73.66,39.88 v73.41,39.62
SWD_IO  (via drill 0.35)
  Top 0.152: MC.46 48.05,58.97 48.26,59.18 78.23,59.18 78.74,58.67 78.74,48.51 v72.39,42.16 | v72.14,39.62 71.88,39.37 70.61,39.37 69.85,38.61 JTAG_HEADER.7
  Bottom 0.152: v72.39,42.16 72.39,39.88 v72.14,39.62
TORPEDO1
  Top 0.152: TORPEDO_CONNECTOR.1 20.13,55.63 27.69,55.63 28.45,54.86 Q18.3
TORPEDO1_GATE  (1 unrouted)
TORPEDO2  (via drill 0.35)
  Top 0.152: TORPEDO_CONNECTOR.2 18.8,61.15 18.8,58.42 20.57,56.64 29.72,56.64 v30.48,55.88 | v32.26,54.1 32.47,54.1 Q6.3
  Bottom 0.152: v30.48,55.88 v32.26,54.1
TORPEDO2_GATE  (1 unrouted)
USB_DN  (1 unrouted)
USB_DP  (1 unrouted)
USB_ID
  Top 0.152: R11.2 R2.1
V+
  Top 1.016: POWER_INPUT.4 22.94,20.99 22.94,18.54 23.95,17.53 47.75,17.53 49.02,18.8 U$6.P$2

### Text on the board
Top: Need to make traces from Coil 24V to connector larger
tPlace: Board Name HERE!!! | The Underwater Robotics Team / Center for Automotive Research